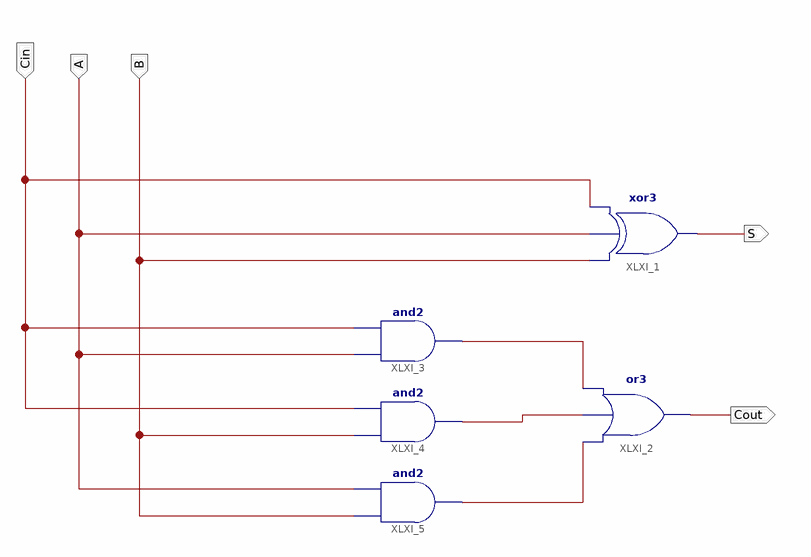
[diagram p0: schematic sheet 1]
// Xilinx ISE schematic p1ej4a.sch (spartan3) as structural Verilog: 5 symbols, 5 ports
module p1ej4a (
  input  Cin,
  input  A,
  input  B,
  output Cout,
  output S
);

  wire XLXN_1, XLXN_2, XLXN_3;

  xor XLXI_1 (S, B, A, Cin);
  or XLXI_2 (Cout, XLXN_3, XLXN_2, XLXN_1);
  and XLXI_3 (XLXN_1, A, Cin);
  and XLXI_4 (XLXN_2, B, Cin);
  and XLXI_5 (XLXN_3, B, A);
endmodule
